# EAGLE board Principal_PCB (EAGLE 8.2.2), part 1 of 2
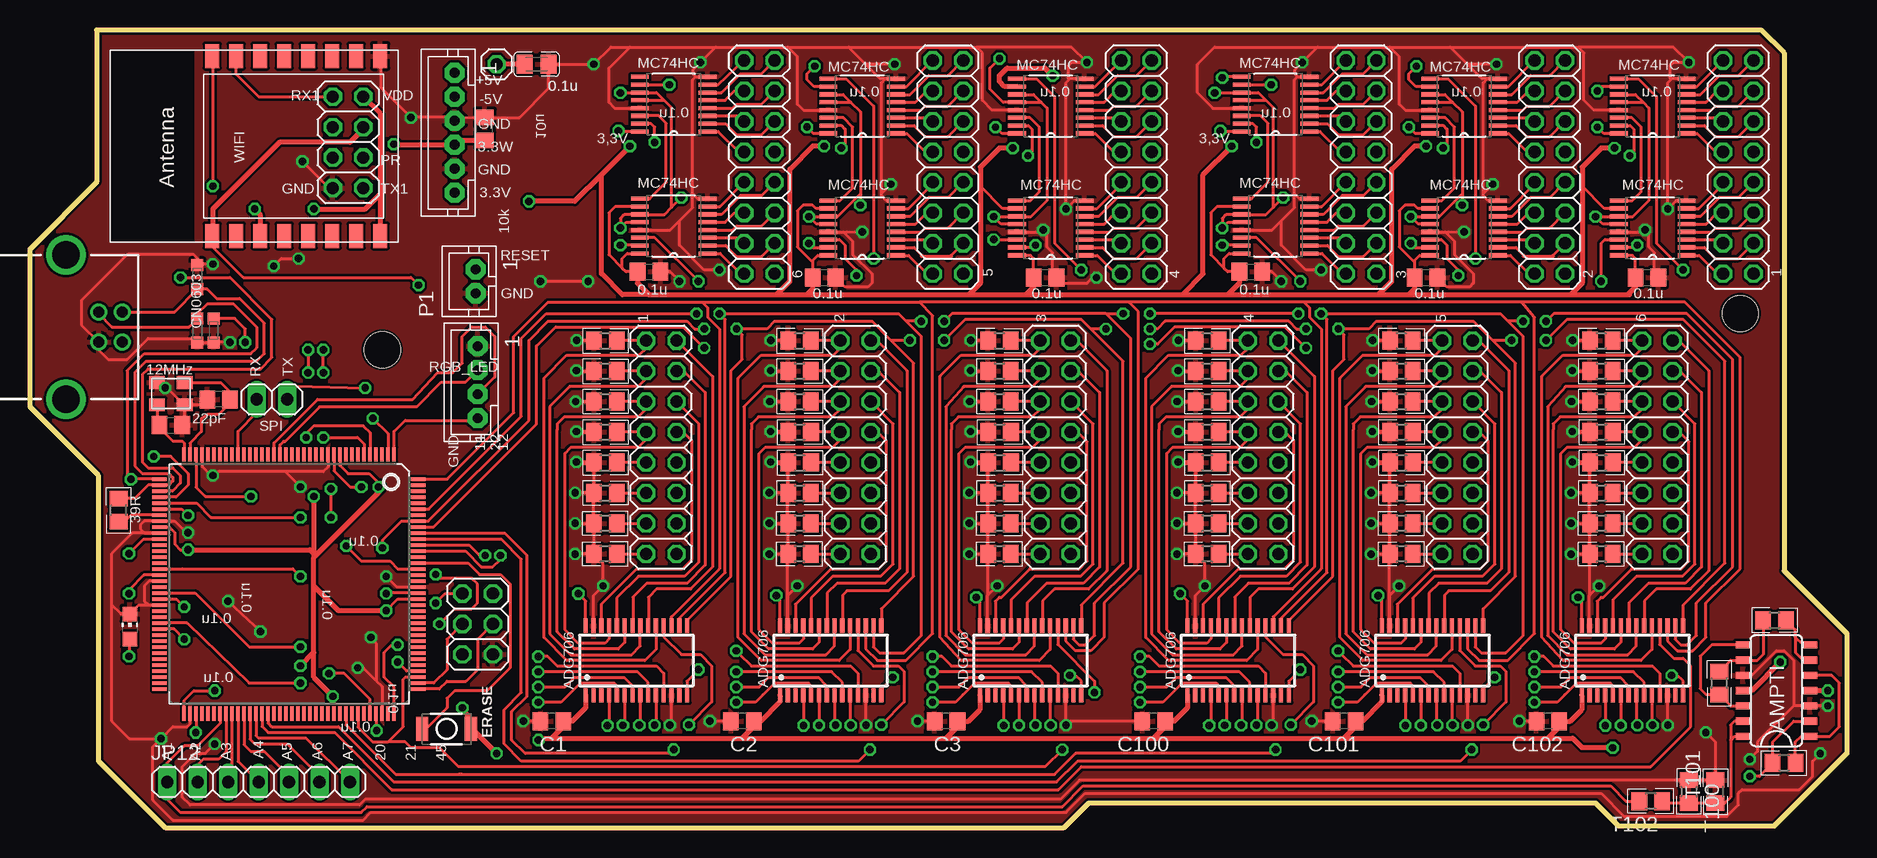
[diagram p7: board, top side]
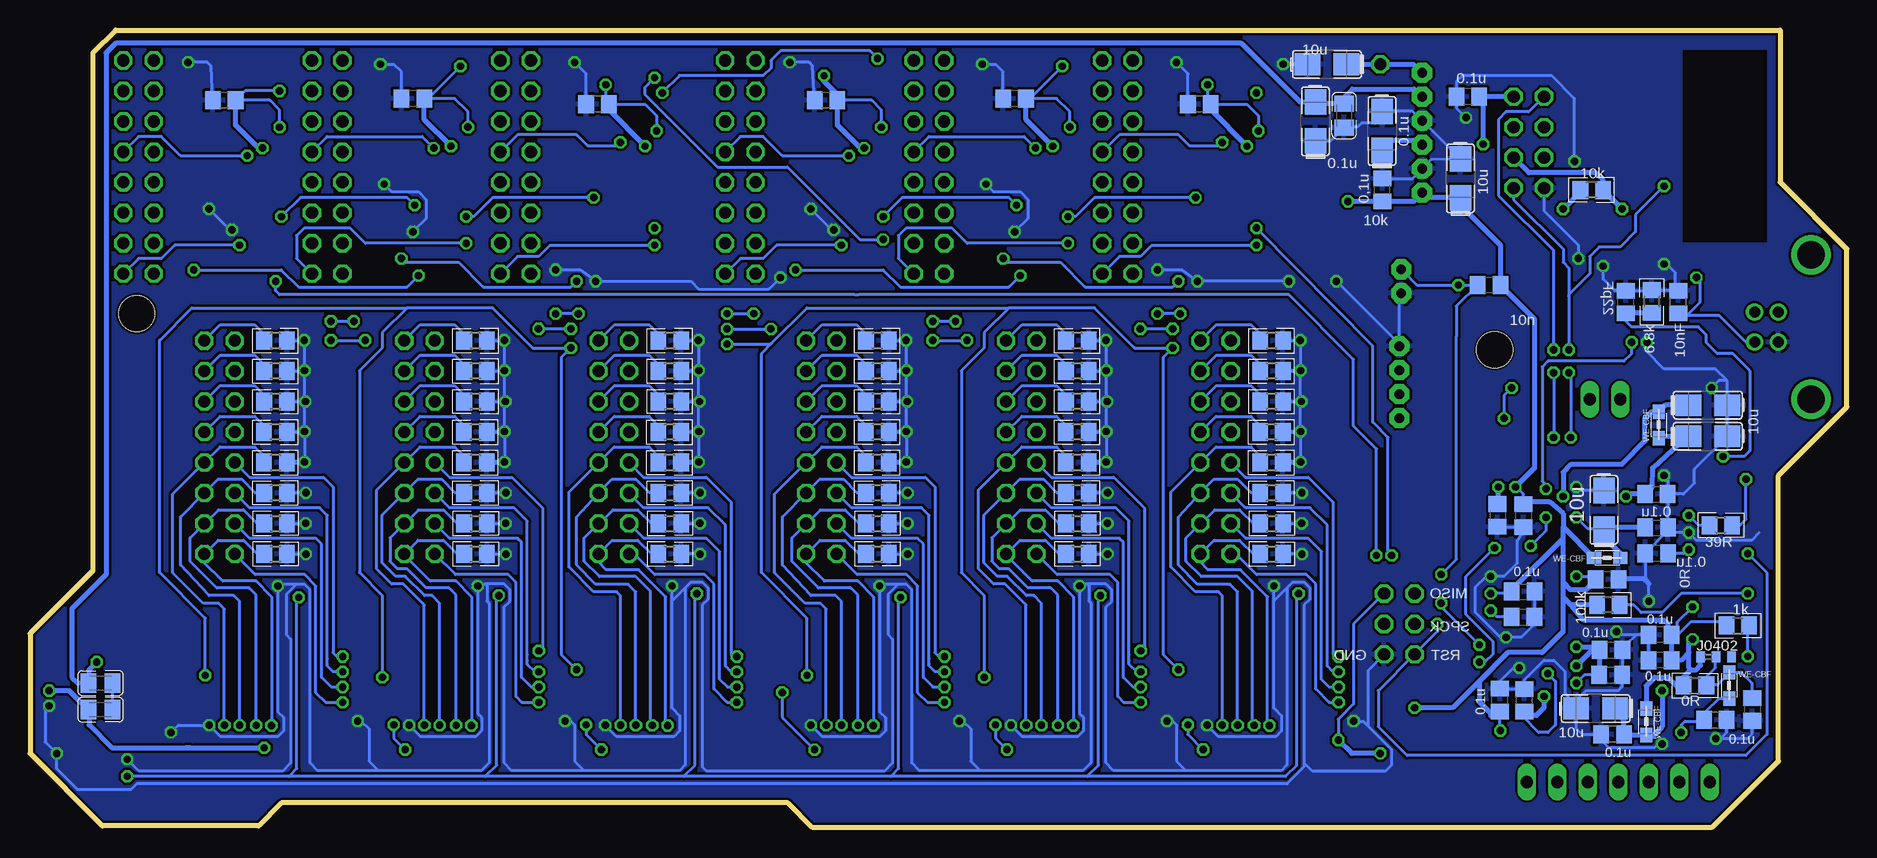
[diagram p8: board, bottom side, seen from below]

Size 151.45 x 66.52 mm. Coordinates in mm from the lower left corner, seen from the top.
Outline: 144.3,66.52 5.56,66.52 5.56,53.82 0,48.26 0,35.08 5.71,29.37 5.71,5.56 11.27,0 86.2,0 88.26,2.06 130.49,2.06 132.4,0.16 145.41,0.16 151.45,6.19 151.45,16.19 146.21,21.43 146.21,64.61 144.3,66.52
Copper layers (1*16): Top 0.035mm / dielectric 1.6mm / Bottom 0.035mm
Design rules "default *": minimum track width 10mil, minimum drill 0.6mm, track to track 8mil, track to pad 8mil, pad to pad 8mil, via to via 8mil, smd to smd 8mil, copper to edge 8mil, drill to drill 8mil, minimum pad ring 10mil, minimum via ring 8mil, stop-mask expansion 4mil, vias tented up to drill 32mil, thermal gap 10mil
Net classes: 1 USB: width 0.203 mm, drill 0.254 mm, clearance 0.203 mm; 2 gnd1: width 0.203 mm, drill 0.254 mm, clearance 0.203 mm; 3 usbvcc: width 0.203 mm, drill 0.254 mm, clearance 0.203 mm; 4 USBpair: width 0.203 mm, drill 0.254 mm, clearance 0.203 mm; 5 UA1: width 0.127 mm, drill 0.254 mm, clearance 0.127 mm
Holes 3 mm at 29.37,39.85 142.56,42.86

## Footprints (pad centres in the part's own frame; a part is rotated, then mirrored left to right if it is on the bottom)
SO014 = smd 0.6 x 1.2: 1 -3.175,-2.8; 2 -1.905,-2.8; 3 -0.635,-2.8; 4 0.635,-2.8; 5 1.905,-2.8; 6 3.175,-2.8; 7 4.445,-2.8; 8 4.445,2.8; 9 3.175,2.8; 10 1.905,2.8; 11 0.635,2.8; 12 -0.635,2.8; 13 -1.905,2.8; 14 -3.175,2.8
J0402 = smd 0.7 x 0.9: 1 -0.65,0; 2 0.65,0; 3 1.95,0
C0805 = smd 1.3 x 1.5: 1 -0.95,0; 2 0.95,0
B/3528-21W = smd 2.15 x 1.8: + 1.625,0; - -1.625,0
C0805K = smd 1.3 x 1.6: 1 -1,0; 2 1,0
SMD_157SW = smd 1.016 x 1.981: 1 -2.032,0; 2 2.032,0
2X08 = drill 1.016 octagon: 1 -8.89,-1.27; 2 -8.89,1.27; 3 -6.35,-1.27; 4 -6.35,1.27; 5 -3.81,-1.27; 6 -3.81,1.27; 7 -1.27,-1.27; 8 -1.27,1.27; 9 1.27,-1.27; 10 1.27,1.27; 11 3.81,-1.27; 12 3.81,1.27; 13 6.35,-1.27; 14 6.35,1.27; 15 8.89,-1.27; 16 8.89,1.27
1X02 = drill 1.016 long: 1 -1.27,0; 2 1.27,0
2X03 = drill 1.016 octagon: 1 -2.54,-1.27; 2 -2.54,1.27; 3 0,-1.27; 4 0,1.27; 5 2.54,-1.27; 6 2.54,1.27
1X01 = drill 1.016 octagon: 1 0,0
2X04 = drill 1.016 octagon: 1 -3.81,-1.27; 2 -3.81,1.27; 3 -1.27,-1.27; 4 -1.27,1.27; 5 1.27,-1.27; 6 1.27,1.27; 7 3.81,-1.27; 8 3.81,1.27
1X07 = drill 1.016 long: 1 -7.62,0; 2 -5.08,0; 3 -2.54,0; 4 0,0; 5 2.54,0; 6 5.08,0; 7 7.62,0
0805 = smd 1.2 x 1: 1 -1.1,0; 2 1.1,0
CHIP-LED0805 = smd 1.2 x 1.2: A 0,-1.05; C 0,1.05
JST-PH2 = drill 0.813 pad 1.676 octagon: 1 1,0; 2 -1,0
JST-PH6 = drill 0.813 pad 1.676 octagon: 1 5,0; 2 3,0; 3 1,0; 4 -1,0; 5 -3,0; 6 -5,0
JST-PH4 = drill 0.813 pad 1.676 octagon: 1 3,0; 2 1,0; 3 -1,0; 4 -3,0
R0805 = smd 1.3 x 1.5: 1 -0.95,0; 2 0.95,0
SOP65P640X120-16N = smd 1.473 x 0.356: 1 -2.819,2.286; 2 -2.819,1.626; 3 -2.819,0.965; 4 -2.819,0.33; 5 -2.819,-0.33; 6 -2.819,-0.965; 7 -2.819,-1.626; 8 -2.819,-2.286; 9 2.819,-2.286; 10 2.819,-1.626; 11 2.819,-0.965; 12 2.819,-0.33; 13 2.819,0.33; 14 2.819,0.965; 15 2.819,1.626; 16 2.819,2.286
LQFP144 = smd 0.3 x 1.2: 1 -8.75,-10.8; 2 -8.25,-10.8; 3 -7.75,-10.8; 4 -7.25,-10.8; 5 -6.75,-10.8; 6 -6.25,-10.8; 7 -5.75,-10.8; 8 -5.25,-10.8; 9 -4.75,-10.8; 10 -4.25,-10.8; 11 -3.75,-10.8; 12 -3.25,-10.8; 13 -2.75,-10.8; 14 -2.25,-10.8; 15 -1.75,-10.8; 16 -1.25,-10.8; 17 -0.75,-10.8; 18 -0.25,-10.8; 19 0.25,-10.8; 20 0.75,-10.8; 21 1.25,-10.8; 22 1.75,-10.8; 23 2.25,-10.8; 24 2.75,-10.8; 25 3.25,-10.8; 26 3.75,-10.8; 27 4.25,-10.8; 28 4.75,-10.8; 29 5.25,-10.8; 30 5.75,-10.8; 31 6.25,-10.8; 32 6.75,-10.8; 33 7.25,-10.8; 34 7.75,-10.8; 35 8.25,-10.8; 36 8.75,-10.8; 73 8.75,10.8; 74 8.25,10.8; 75 7.75,10.8; 76 7.25,10.8; 77 6.75,10.8; 78 6.25,10.8; 79 5.75,10.8; 80 5.25,10.8; 81 4.75,10.8; 82 4.25,10.8; 83 3.75,10.8; 84 3.25,10.8; 85 2.75,10.8; 86 2.25,10.8; 87 1.75,10.8; 88 1.25,10.8; 89 0.75,10.8; 90 0.25,10.8; 91 -0.25,10.8; 92 -0.75,10.8; 93 -1.25,10.8; 94 -1.75,10.8; 95 -2.25,10.8; 96 -2.75,10.8; 97 -3.25,10.8; 98 -3.75,10.8; 99 -4.25,10.8; 100 -4.75,10.8; 101 -5.25,10.8; 102 -5.75,10.8; 103 -6.25,10.8; 104 -6.75,10.8; 105 -7.25,10.8; 106 -7.75,10.8; 107 -8.25,10.8; 108 -8.75,10.8 | smd 1.2 x 0.3: 37 10.8,-8.75; 38 10.8,-8.25; 39 10.8,-7.75; 40 10.8,-7.25; 41 10.8,-6.75; 42 10.8,-6.25; 43 10.8,-5.75; 44 10.8,-5.25; 45 10.8,-4.75; 46 10.8,-4.25; 47 10.8,-3.75; 48 10.8,-3.25; 49 10.8,-2.75; 50 10.8,-2.25; 51 10.8,-1.75; 52 10.8,-1.25; 53 10.8,-0.75; 54 10.8,-0.25; 55 10.8,0.25; 56 10.8,0.75; 57 10.8,1.25; 58 10.8,1.75; 59 10.8,2.25; 60 10.8,2.75; 61 10.8,3.25; 62 10.8,3.75; 63 10.8,4.25; 64 10.8,4.75; 65 10.8,5.25; 66 10.8,5.75; 67 10.8,6.25; 68 10.8,6.75; 69 10.8,7.25; 70 10.8,7.75; 71 10.8,8.25; 72 10.8,8.75; 109 -10.8,8.75; 110 -10.8,8.25; 111 -10.8,7.75; 112 -10.8,7.25; 113 -10.8,6.75; 114 -10.8,6.25; 115 -10.8,5.75; 116 -10.8,5.25; 117 -10.8,4.75; 118 -10.8,4.25; 119 -10.8,3.75; 120 -10.8,3.25; 121 -10.8,2.75; 122 -10.8,2.25; 123 -10.8,1.75; 124 -10.8,1.25; 125 -10.8,0.75; 126 -10.8,0.25; 127 -10.8,-0.25; 128 -10.8,-0.75; 129 -10.8,-1.25; 130 -10.8,-1.75; 131 -10.8,-2.25; 132 -10.8,-2.75; 133 -10.8,-3.25; 134 -10.8,-3.75; 135 -10.8,-4.25; 136 -10.8,-4.75; 137 -10.8,-5.25; 138 -10.8,-5.75; 139 -10.8,-6.25; 140 -10.8,-6.75; 141 -10.8,-7.25; 142 -10.8,-7.75; 143 -10.8,-8.25; 144 -10.8,-8.75
TSSOP28 = smd 0.35 x 1.2: 1 -4.225,-2.9; 2 -3.575,-2.9; 3 -2.925,-2.9; 4 -2.275,-2.9; 5 -1.625,-2.9; 6 -0.975,-2.9; 7 -0.325,-2.9; 8 0.325,-2.9; 9 0.975,-2.9; 10 1.625,-2.9; 11 2.275,-2.9; 12 2.925,-2.9; 13 3.575,-2.9; 14 4.225,-2.9; 15 4.225,2.9; 16 3.575,2.9; 17 2.925,2.9; 18 2.275,2.9; 19 1.625,2.9; 20 0.975,2.9; 21 0.325,2.9; 22 -0.325,2.9; 23 -0.975,2.9; 24 -1.625,2.9; 25 -2.275,2.9; 26 -2.925,2.9; 27 -3.575,2.9; 28 -4.225,2.9
ESP-12 = smd 2 x 1.2: 1 -7.5,4.5; 2 -7.5,2.5; 3 -7.5,0.5; 4 -7.5,-1.5; 5 -7.5,-3.5; 6 -7.5,-5.5; 7 -7.5,-7.5; 8 -7.5,-9.5; 9 7.5,-9.5; 10 7.5,-7.5; 11 7.5,-5.5; 12 7.5,-3.5; 13 7.5,-1.5; 14 7.5,0.5; 15 7.5,2.5; 16 7.5,4.5
USB-B-PTH = drill 0.914: D+ 0,1.25; D- 1.981,1.25; GND 0,-1.25; VBUS 1.981,-1.25 | drill 2.286: P$1 -2.718,-6.02; P$2 -2.718,6.02
CRYSTAL-3.2-2.5 = smd 1.3 x 1.05: 1 -1.15,-0.925; 2 1.15,-0.925; 3 1.15,0.925; 4 -1.15,0.925
CT/CN0603 = smd 1 x 1: 1 -1,0; 2 1,0

## Placement (x,y rotation side)
AMPTI  LMV324  [SO014]  145.57,10.8 90 top
BR1  NM  [J0402]  10.25,14.24 180 bottom
C1  [C0805]  43.5,8.89 180 top
C2  [C0805]  59.37,8.89 180 top
C3  [C0805]  76.36,8.89 180 top
C4  [C0805]  84.61,45.88 0 top
C5  [C0805]  85.09,60.64 180 bottom
C6  [C0805]  66.2,45.88 0 top
C7  0.1uF  [C0805]  69.37,60.8 180 bottom
C8  [C0805]  51.59,46.36 0 top
C9  [C0805]  53.98,60.33 180 bottom
C100  [C0805]  93.66,8.89 180 top
C101  [C0805]  109.54,8.89 180 top
C102  [C0805]  126.52,8.89 180 top
C103  [C0805]  101.76,46.36 0 top
C104  [C0805]  116.36,45.88 0 top
C105  [C0805]  134.78,45.88 0 top
C106  [C0805]  104.14,60.33 180 bottom
C107  0.1uF  [C0805]  119.54,60.8 180 bottom
C108  [C0805]  135.25,60.64 180 bottom
CA1  0,1u  [C0805]  38.73,53.18 90 bottom
CA2  10u  [B/3528-21W]  32.2,54.15 270 bottom
CA3  100n  [C0805]  28.92,10.65 90 bottom
CA4  100n  [C0805]  15.57,16.1 180 bottom
CA5  100n  [C0805]  15.57,13.97 180 bottom
CA6  100n  [C0805]  19.99,20.7 0 bottom
CA7  100n  [C0805]  37.91,58.27 90 top
CA8  100n  [C0805]  26.96,26.02 270 bottom
CA9  100n  [C0805]  26.99,19.69 0 bottom
CA10  100n  [C0805]  15.86,25.02 0 bottom
CA11  10u  [B/3528-21W]  20.24,26.5 270 bottom
CA12  100n  [C0805]  19.54,7.78 180 bottom
CA13  10u  [B/3528-21W]  20.95,9.95 0 bottom
CA14  10u  [B/3528-21W]  11.6,35.23 180 bottom
CA15  100n  [C0805]  19.67,14.83 0 bottom
CA16  100n  [C0805]  19.7,12.73 0 bottom
CA17  100n  [C0805]  29.11,26.05 270 bottom
CA18  100n  [C0805]  15.86,22.86 180 bottom
CA19  100n  [C0805]  26.89,10.62 90 bottom
CA20  100n  [C0805]  27,17.59 0 bottom
CA21  10n  [C0805]  29.83,45.23 180 bottom
CA22  100n  [C0805]  7.89,9.86 270 bottom
CA23  100n  [C0805]  10.97,8.99 0 bottom
CA24  22p  [C0805]  11.73,33.56 0 top
CA25  22pF  [C0805]  15.73,35.72 180 top
CA26  100n  [C0805]  15.89,27.81 0 bottom
CA27  10u  [B/3528-21W]  11.6,32.63 180 bottom
CA28  0.1u  [C0805K]  145.57,9.84 0 bottom
CA29  0.1u  [C0805K]  145.57,12.06 180 bottom
CA35  22p  [C0805]  18.41,43.83 90 bottom
CA36  10n  [C0805]  14.07,43.83 90 bottom
CA37  10uF  [B/3528-21W]  43.34,63.66 0 bottom
CA38  100n  [C0805]  31.59,60.96 180 bottom
CA49  10u  [B/3528-21W]  38.73,58.1 270 bottom
CA50  10uF  [B/3528-21W]  44.29,58.9 270 bottom
CA51  0.1u  [C0805K]  41.91,59.37 270 bottom
CA54  0.1u  [C0805K]  42.23,63.66 0 top
ERASE  [SMD_157SW]  34.72,8.24 180 top
JP1  [2X08]  142.4,55.09 90 top
JP2  [2X08]  126.68,55.09 90 top
JP3  [2X08]  110.97,55.09 90 top
JP4  [2X08]  92.23,55.09 90 top
JP5  [2X08]  76.52,55.09 90 top
JP6  [2X08]  60.8,55.09 90 top
JP8  [1X02]  20.16,35.72 0 top
JP9  [2X03]  37.31,16.99 270 top
JP10  [1X01]  38.89,63.66 0 top
JP11  [2X04]  26.51,57.15 270 top
JP12  [1X07]  19.05,3.81 0 top
JPP1  [2X08]  52.62,31.72 90 top
JPP2  [2X08]  68.81,31.72 90 top
JPP3  [2X08]  85.48,31.72 90 top
JPP4  [2X08]  102.79,31.72 90 top
JPP5  [2X08]  118.98,31.72 90 top
JPP6  [2X08]  135.65,31.72 90 top
L1  MH2029-300Y  [0805]  16.72,8.84 270 bottom
L2  MH2029-300Y  [0805]  19.98,22.49 0 bottom
L3  MH2029-300Y  [0805]  9.82,11.86 270 bottom
L5  MH2029-300Y  [0805]  15.69,33.59 270 bottom
ON  GREEN  [CHIP-LED0805]  8.32,16.76 0 top
P1  [JST-PH2]  37.15,45.56 90 top
P2  [JST-PH6]  35.4,57.94 90 top
P4  [JST-PH4]  37.31,37.15 90 top
RA3  1k  [R0805]  9.09,16.86 0 bottom
RA4  0R  [R0805]  12.67,11.86 0 bottom
RA5  100k  [R0805]  19.89,18.57 180 bottom
RA7  39R 1%  [R0805]  7.38,26.48 90 top
RA8  39R 1%  [R0805]  10.51,25.22 0 bottom
RA9  6K8 1%  [R0805]  16.26,43.88 90 bottom
RF4  10k  [R0805]  21.27,53.18 180 bottom
T1  [R0805]  47.95,40.6 0 top
T2  [R0805]  47.95,40.6 180 bottom
T3  [R0805]  47.95,38.07 0 top
T4  [R0805]  47.95,38.07 180 bottom
T5  [R0805]  47.95,35.54 180 bottom
T6  [R0805]  47.96,32.99 180 bottom
T7  [R0805]  47.96,30.44 180 bottom
T8  [R0805]  47.95,27.91 0 top
T9  [R0805]  98.12,38.07 0 top
T10  [R0805]  47.95,25.37 180 top
T11  [R0805]  47.95,25.37 0 bottom
T12  [R0805]  47.95,22.83 180 top
T13  [R0805]  47.95,22.83 0 bottom
T14  [R0805]  47.95,35.54 0 top
T15  [R0805]  47.96,32.99 0 top
T16  [R0805]  47.96,30.44 0 top
T17  [R0805]  47.95,27.91 180 bottom
T18  [R0805]  64.15,40.6 0 top
T19  [R0805]  64.15,40.6 180 bottom
T20  [R0805]  64.15,38.07 0 top
T21  [R0805]  64.15,38.07 180 bottom
T22  [R0805]  64.15,35.54 0 top
T23  [R0805]  64.16,32.99 0 top
T24  [R0805]  64.16,30.44 0 top
T25  [R0805]  64.15,27.91 0 top
T26  [R0805]  64.15,25.37 180 top
T27  [R0805]  64.15,25.37 0 bottom
T28  [R0805]  64.15,22.83 180 top
T29  [R0805]  64.15,22.83 0 bottom
T30  [R0805]  64.15,35.54 180 bottom
T31  [R0805]  64.16,32.99 180 bottom
T32  [R0805]  64.16,30.44 180 bottom
T33  [R0805]  64.15,27.91 180 bottom
T34  [R0805]  80.81,40.6 0 top
T35  [R0805]  80.81,40.6 180 bottom
T36  [R0805]  80.81,38.07 0 top
T37  [R0805]  80.81,38.07 180 bottom
T38  [R0805]  80.81,35.54 180 bottom
T39  [R0805]  80.82,32.99 0 top
T40  [R0805]  80.82,30.44 0 top
T41  [R0805]  80.81,27.91 0 top
T42  [R0805]  80.81,25.37 180 top
T43  [R0805]  80.81,25.37 0 bottom
T44  [R0805]  80.81,22.83 180 top
T45  [R0805]  80.81,22.83 0 bottom
T46  [R0805]  80.81,35.54 0 top
T47  [R0805]  80.82,32.99 180 bottom
T48  [R0805]  80.82,30.44 180 bottom
T49  [R0805]  80.81,27.91 180 bottom
T50  [R0805]  98.12,38.07 180 bottom
T51  [R0805]  98.12,35.54 0 top
T52  [R0805]  146.21,5.4 180 top
T53  [R0805]  145.41,17.3 0 top
T54  [R0805]  140.81,12.06 90 top
T55  [R0805]  98.12,35.54 180 bottom
T56  [R0805]  98.13,32.99 0 top
T57  [R0805]  98.13,32.99 180 bottom
T58  [R0805]  98.13,30.44 0 top
T59  [R0805]  98.13,30.44 180 bottom
T60  [R0805]  98.12,27.91 0 top
T61  [R0805]  98.12,27.91 180 bottom
T62  [R0805]  98.12,22.83 180 top
T63  [R0805]  98.12,22.83 0 bottom
T64  [R0805]  98.12,40.6 180 bottom
T65  [R0805]  98.12,25.37 0 bottom
T66  [R0805]  98.12,40.6 0 top
T67  [R0805]  98.12,25.37 180 top
T68  [R0805]  114.31,38.07 0 top
T69  [R0805]  114.31,38.07 180 bottom
T70  [R0805]  114.31,35.54 0 top
T71  [R0805]  114.31,35.54 180 bottom
T72  [R0805]  114.32,32.99 0 top
T73  [R0805]  114.32,32.99 180 bottom
T74  [R0805]  114.32,30.44 0 top
T75  [R0805]  114.32,30.44 180 bottom
T76  [R0805]  114.31,27.91 0 top
T77  [R0805]  114.31,27.91 180 bottom
T78  [R0805]  114.31,22.83 180 top
T79  [R0805]  114.31,22.83 0 bottom
T80  [R0805]  114.31,40.6 180 bottom
T81  [R0805]  114.31,25.37 0 bottom
T82  [R0805]  114.31,40.6 0 top
T83  [R0805]  114.31,25.37 180 top
T84  [R0805]  130.98,38.07 0 top
T85  [R0805]  130.98,38.07 180 bottom
T86  [R0805]  130.98,35.54 0 top
T87  [R0805]  130.98,35.54 180 bottom
T88  [R0805]  130.99,32.99 0 top
T89  [R0805]  130.99,32.99 180 bottom
T90  [R0805]  130.99,30.44 0 top
T91  [R0805]  130.99,30.44 180 bottom
T92  [R0805]  130.98,27.91 0 top
T93  [R0805]  130.98,27.91 180 bottom
T94  [R0805]  130.98,22.83 180 top
T95  [R0805]  130.98,22.83 0 bottom
T96  [R0805]  130.98,40.6 180 bottom
T97  [R0805]  130.98,25.37 0 bottom
T98  [R0805]  130.98,40.6 0 top
T99  [R0805]  130.98,25.37 180 top
T100  [R0805]  138.27,3.02 270 top
T101  [R0805]  140.49,3.02 90 top
T102  [R0805]  135.1,2.22 180 top
U4  MC74HC595ADTR2G  [SOP65P640X120-16N]  85.09,50.01 180 top
U5  MC74HC595ADTR2G  [SOP65P640X120-16N]  85.09,60.17 180 top
U6  MC74HC595ADTR2G  [SOP65P640X120-16N]  69.37,50.01 180 top
U7  MC74HC595ADTR2G  [SOP65P640X120-16N]  69.37,60.17 180 top
U8  MC74HC595ADTR2G  [SOP65P640X120-16N]  53.66,50.17 180 top
U9  MC74HC595ADTR2G  [SOP65P640X120-16N]  53.66,60.33 180 top
UA1  ATSAM3X8EA-AU  [LQFP144]  21.59,20.32 180 top
UU1  ADG706BRU  [TSSOP28]  50.54,13.94 0 top
UU2  ADG706BRU  [TSSOP28]  66.73,13.94 0 top
UU3  ADG706BRU  [TSSOP28]  83.4,13.94 0 top
UU4  ADG706BRU  [TSSOP28]  100.71,13.94 0 top
UU5  ADG706BRU  [TSSOP28]  116.9,13.94 0 top
UU6  ADG706BRU  [TSSOP28]  133.57,13.94 0 top
UUU1  MC74HC595ADTR2G  [SOP65P640X120-16N]  135.25,50.01 180 top
UUU2  MC74HC595ADTR2G  [SOP65P640X120-16N]  135.25,60.17 180 top
UUU3  MC74HC595ADTR2G  [SOP65P640X120-16N]  119.54,50.01 180 top
UUU4  MC74HC595ADTR2G  [SOP65P640X120-16N]  119.54,60.17 180 top
UUU5  MC74HC595ADTR2G  [SOP65P640X120-16N]  103.82,50.17 180 top
UUU6  MC74HC595ADTR2G  [SOP65P640X120-16N]  103.82,60.33 180 top
X1  [ESP-12]  19.69,56.83 90 top
X3  USBPTH  [USB-B-PTH]  5.71,41.75 0 top
Y1  12MHz KX-7 20pF  [CRYSTAL-3.2-2.5]  11.75,36.2 0 top
Z1  CG0603MLC-05E  [CT/CN0603]  13.96,41.45 270 top
Z2  CG0603MLC-05E  [CT/CN0603]  13.96,45.9 90 top
Z5  CG0603MLC-05E  [CT/CN0603]  15.31,41.46 90 top

## Tracks (layer width: path | path; a pad name or v marks a point on that pad's centre or on a via)
49
  Top 0.254: JPP4.15 104.58,40.13 107.07,37.64 107.07,21.75 105.23,19.91 102.39,19.91 101.71,19.22 101.71,16.87 UU4.20
  Bottom 0.254: JPP4.15 102.73,41.94 99.84,41.94 99.07,41.17 T64.2
50
  Top 0.254: T66.2 JPP4.16 101.59,40.54 101.59,40.03 100.95,39.39 94.91,39.39 93,37.49 93,15.86 94.91,13.95 101.43,13.95 102.33,14.86 UU4.19
51
  Top 0.254: T9.2 JPP4.14 101.52,37.45 100.85,36.78 95.16,36.78 | 95.16,36.78 95.11,36.78 | 95.16,36.78 93.48,35.1 93.48,16.18 95.23,14.43 100.32,14.43 101.03,15.15 UU4.21
52
  Top 0.254: T51.2 99.06,35.53 JPP4.12 101.52,34.93 100.84,34.25 94.7,34.25 94.12,33.67 94.12,33.19 | UU4.23 99.73,15.44 99.2,14.91 95.55,14.91 94.12,16.34 94.12,33.19 | 94.12,33.19
53
  Top 0.254: UU4.24 99.08,19.15 100.88,20.96 104.72,20.96 105.92,22.15 105.92,33.67 JPP4.11
  Bottom 0.254: JPP4.11 102.74,36.85 99.84,36.85 99.07,36.08 T55.2
54
  Top 0.254: T56.2 JPP4.10 101.52,32.36 100.85,31.69 95.23,31.69 94.75,31.22 94.75,16.5 95.87,15.38 98.09,15.38 98.43,15.73 UU4.25
55
  Top 0.254: JPP4.9 104.61,32.99 105.31,32.29 105.31,22.35 104.51,21.55 100.7,21.55 97.78,18.63 UU4.26
  Bottom 0.254: JPP4.9 102.74,34.31 99.84,34.31 99.08,33.54 T57.2
56  (via drill 0.61)
  Top 0.254: UU4.10 102.33,8.65 v102.22,8.55
  Bottom 0.254: v102.22,8.55 102.22,19.35 102.54,19.67 104.45,19.67 106.52,21.73 106.52,27.99 JPP4.7 102.75,31.76 99.84,31.76 99.08,31 T59.2
57  (via drill 0.61)
  Top 0.254: JPP4.8 T58.2 | UU4.11 102.98,12.88 102.38,13.48 94.12,13.48 93.32,14.27 v92.53,14.27
  Bottom 0.254: JPP4.8 100.29,29.22 95.07,29.22 93,27.15 93,14.43 92.84,14.27 v92.53,14.27
58  (via drill 0.61)
  Top 0.254: UU4.8 101.03,8.63 v100.95,8.55
  Bottom 0.254: v100.95,8.55 100.95,19.67 101.59,20.3 104.29,20.3 105.88,21.89 105.88,25.93 JPP4.5 102.91,29.06 100.95,29.06 99.84,27.95 99.1,27.95 T61.2
59  (via drill 0.61)
  Top 0.254: T60.2 JPP4.6 | UU4.9 101.68,12.11 100.79,13 v92.53,13
  Bottom 0.254: v92.53,13 93,13 93.48,13.48 93.48,14.11 93.48,14.59 93.48,25.24 94.91,26.67 100.28,26.67 JPP4.6
60  (via drill 0.61)
  Top 0.254: UU4.6 99.73,8.69 v99.58,8.53
  Bottom 0.254: T65.1 99.65,25.37 100.79,26.52 102.86,26.52 104.01,25.37 JPP4.3 105.25,24.18 105.25,22.21 103.97,20.94 100.95,20.94 99.74,19.72 99.74,8.69 v99.58,8.53
61  (via drill 0.61)
  Top 0.254: T67.1 JPP4.4 | UU4.7 100.38,11.82 99.68,12.52 95.55,12.52 94.75,11.73 v92.53,11.73
  Bottom 0.254: JPP4.4 100.28,24.13 95.07,24.13 93.96,23.02 93.96,12.36 93.32,11.73 v92.53,11.73
62  (via drill 0.61)
  Top 0.254: UU4.4 98.43,8.65 v98.3,8.52
  Bottom 0.254: T63.1 99.65,22.83 100.79,23.97 102.92,23.97 JPP4.1 104.06,22.14 103.43,21.51 102.68,21.51 100.7,21.51 98.46,19.27 98.46,8.68 v98.3,8.52
63  (via drill 0.61)
  Top 0.254: T62.1 JPP4.2 | UU4.5 99.08,11.85 98.89,12.05 96.02,12.05 95.07,11.09 | 95.07,11.09 | 95.07,11.09 94.43,10.46 v92.53,10.46
  Bottom 0.254: v92.53,10.46 93.32,10.46 94.44,11.57 94.44,20.31 95.23,21.11 99.37,21.11 101.09,22.83 JPP4.2
64
  Top 0.254: JPP4.13 104.75,38.07 104.75,38.01 106.46,36.3 106.46,21.9 104.94,20.39 101.56,20.39 100.42,19.24 100.42,16.87 UU4.22
  Bottom 0.254: JPP4.13 102.73,39.39 99.84,39.39 99.07,38.62 T50.2
65
  Top 0.254: JPP5.15 120.77,40.61 123.27,38.11 123.27,21.27 121.74,19.75 118.27,19.75 117.9,19.38 117.9,16.87 UU5.20
  Bottom 0.254: JPP5.15 118.92,41.94 116.03,41.94 115.26,41.17 T80.2
66
  Top 0.254: T82.2 JPP5.16 117.78,40.54 117.78,40.03 117.15,39.39 111.1,39.39 109.2,37.49 109.2,15.86 111.1,13.95 117.62,13.95 118.53,14.86 UU5.19
67
  Top 0.254: T68.2 JPP5.14 117.71,37.45 117.04,36.78 111.35,36.78 | 111.35,36.78 111.3,36.78 | 111.35,36.78 109.67,35.1 109.67,16.18 111.42,14.43 116.51,14.43 117.22,15.15 UU5.21
68
  Top 0.254: T70.2 115.25,35.53 JPP5.12 117.71,34.93 117.03,34.25 110.89,34.25 110.31,33.67 110.31,33.19 | UU5.23 115.93,15.44 115.4,14.91 111.74,14.91 110.31,16.34 110.31,33.19 | 110.31,33.19
69
  Top 0.254: UU5.24 115.27,19.15 117.07,20.96 121.08,20.96 122.11,21.99 122.11,33.67 JPP5.11
  Bottom 0.254: JPP5.11 118.93,36.85 116.03,36.85 115.26,36.08 T71.2
70
  Top 0.254: T72.2 JPP5.10 117.71,32.36 117.04,31.69 111.42,31.69 110.94,31.22 110.94,16.5 112.06,15.38 114.28,15.38 114.62,15.73 UU5.25
71
  Top 0.254: JPP5.9 120.8,32.99 121.5,32.29 121.5,22.19 120.87,21.55 116.89,21.55 113.97,18.63 UU5.26
  Bottom 0.254: JPP5.9 118.93,34.31 116.03,34.31 115.27,33.54 T73.2
72  (via drill 0.61)
  Top 0.254: UU5.10 118.53,8.65 v118.58,8.55
  Bottom 0.254: v118.58,8.55 118.58,18.56 118.74,18.71 118.74,18.72 120.33,20.32 121.28,20.32 122.56,21.59 122.56,28.14 122.55,28.15 JPP5.7 118.94,31.76 116.03,31.76 115.27,31 T75.2
73  (via drill 0.61)
  Top 0.254: JPP5.8 T74.2 | UU5.11 119.18,12.88 118.58,13.48 110.31,13.48 109.35,14.43 v109.04,14.75
  Bottom 0.254: JPP5.8 116.48,29.22 111.26,29.22 108.72,26.68 108.72,15.07 108.88,14.91 v109.04,14.75
74  (via drill 0.61)
  Top 0.254: UU5.8 117.22,8.63 v117.31,8.55
  Bottom 0.254: v117.31,8.55 117.31,18.71 117.94,19.35 118.57,19.35 120.17,20.95 120.97,20.95 122.08,22.07 122.08,26.08 JPP5.5 119.1,29.06 117.15,29.06 116.03,27.95 115.3,27.95 T77.2
75  (via drill 0.61)
  Top 0.254: T76.2 JPP5.6 | UU5.9 117.88,12.11 116.99,13 v109.04,13
  Bottom 0.254: v109.04,13 109.35,13 109.99,13.64 109.99,13.95 109.99,14.43 109.99,25.56 111.1,26.67 116.47,26.67 JPP5.6
76  (via drill 0.61)
  Top 0.254: UU5.6 v115.93,8.53
  Bottom 0.254: v115.93,8.53 115.93,19.41 116.53,20 118.43,20 120.01,21.59 120.81,21.59 121.44,22.22 121.44,24.18 JPP5.3 120.2,25.37 119.05,26.52 116.99,26.52 115.84,25.37 T81.1
77  (via drill 0.61)
  Top 0.254: T83.1 JPP5.4 | UU5.7 116.57,11.82 115.87,12.52 111.74,12.52 110.94,11.73 v109.04,11.73
  Bottom 0.254: JPP5.4 116.47,24.13 110.79,24.13 110.47,23.81 110.47,12.52 109.67,11.73 v109.04,11.73
78  (via drill 0.61)
  Top 0.254: UU5.4 114.62,8.54 v114.65,8.52
  Bottom 0.254: T79.1 115.85,22.83 116.99,23.97 119.11,23.97 JPP5.1 120.25,22.73 118.08,20.56 115.94,20.56 114.65,19.27 v114.65,8.52
79  (via drill 0.61)
  Top 0.254: T78.1 JPP5.2 | UU5.5 115.28,11.85 115.08,12.05 112.22,12.05 111.26,11.09 | 111.26,11.09 | 111.26,11.09 110.63,10.46 v109.04,10.46
  Bottom 0.254: JPP5.2 115.99,21.11 111.58,21.11 110.94,20.47 110.94,10.93 110.47,10.46 v109.04,10.46
80
  Top 0.254: JPP5.13 120.94,38.07 120.94,38.01 122.65,36.3 122.65,21.58 121.45,20.39 117.44,20.39 116.61,19.56 116.61,16.87 UU5.22
  Bottom 0.254: JPP5.13 118.93,39.39 116.03,39.39 115.26,38.62 T69.2
81
  Top 0.254: JPP6.15 137.44,40.61 139.94,38.11 139.94,21.43 138.41,19.91 135.57,19.91 134.57,18.9 134.57,16.87 UU6.20
  Bottom 0.254: JPP6.15 135.59,41.94 132.7,41.94 131.93,41.17 T96.2
82
  Top 0.254: T98.2 JPP6.16 134.45,40.54 134.45,40.03 133.81,39.39 127.77,39.39 126.02,37.65 126.02,15.86 127.77,13.95 134.29,13.95 135.19,14.86 UU6.19
83
  Top 0.254: T84.2 JPP6.14 134.38,37.45 133.71,36.78 128.02,36.78 | 128.02,36.78 127.97,36.78 | 128.02,36.78 126.5,35.1 126.5,16.02 128.09,14.43 133.18,14.43 133.89,15.15 UU6.21
84
  Top 0.254: T86.2 131.92,35.53 JPP6.12 134.38,34.93 133.7,34.25 127.56,34.25 126.98,33.67 126.98,33.19 | UU6.23 132.59,15.44 132.07,14.91 128.41,14.91 126.98,16.34 126.98,33.19 | 126.98,33.19
85
  Top 0.254: UU6.24 131.94,19 133.9,20.96 137.74,20.96 138.78,21.99 138.78,33.67 JPP6.11
  Bottom 0.254: JPP6.11 135.6,36.85 132.7,36.85 131.93,36.08 T87.2
86
  Top 0.254: T88.2 JPP6.10 134.38,32.36 133.71,31.69 128.09,31.69 127.61,31.22 127.61,16.5 128.73,15.38 130.95,15.38 131.29,15.73 UU6.25
87
  Top 0.254: JPP6.9 137.47,32.99 138.27,32.19 138.27,22.23 137.64,21.59 133.51,21.59 131.13,19.21 130.97,19.21 130.64,18.88 UU6.26
  Bottom 0.254: JPP6.9 135.6,34.31 132.7,34.31 131.94,33.54 T89.2
88  (via drill 0.61)
  Top 0.254: UU6.10 135.19,8.65 v135.25,8.55
  Bottom 0.254: v135.25,8.55 135.25,18.24 135.72,18.71 137,18.71 139.54,21.26 139.54,27.83 JPP6.7 135.61,31.76 132.7,31.76 131.94,31 T91.2
89  (via drill 0.61)
  Top 0.254: JPP6.8 T90.2 | UU6.11 135.84,12.88 135.25,13.48 126.98,13.48 126.18,14.27 v125.39,14.27
  Bottom 0.254: JPP6.8 133.15,29.22 126.98,29.22 126.18,28.42 126.18,14.59 125.87,14.27 v125.39,14.27
90  (via drill 0.61)
  Top 0.254: UU6.8 133.89,8.63 v133.97,8.55
  Bottom 0.254: v133.97,8.55 133.97,18.87 134.45,19.35 136.52,19.35 138.9,21.89 138.9,25.93 JPP6.5 135.77,29.06 133.81,29.06 132.7,27.95 131.97,27.95 T93.2
91  (via drill 0.61)
  Top 0.254: T92.2 JPP6.6 | UU6.9 134.54,12.11 133.66,13 v125.39,13
  Bottom 0.254: v125.39,13 126.18,13 126.66,13.48 126.66,13.64 126.66,14.11 126.66,26.04 127.3,26.67 133.14,26.67 JPP6.6
92  (via drill 0.61)
  Top 0.254: UU6.6 v132.59,8.53 v132.6,8.53
  Bottom 0.254: v132.6,8.53 132.6,19.41 133.18,19.99 135.88,19.99 138.11,22.21 138.11,24.18 JPP6.3 136.87,25.37 135.72,26.52 133.66,26.52 132.51,25.37 T97.1
93  (via drill 0.61)
  Top 0.254: T99.1 JPP6.4 | UU6.7 133.24,11.82 132.54,12.52 128.41,12.52 127.61,11.73 v125.39,11.73
  Bottom 0.254: JPP6.4 133.14,24.13 127.61,24.13 127.14,23.65 127.14,12.52 126.34,11.73 v125.39,11.73
94  (via drill 0.61)
  Top 0.254: UU6.4 131.29,8.54 v131.32,8.52
  Bottom 0.254: T95.1 132.51,22.83 133.66,23.97 135.78,23.97 JPP6.1 136.92,22.09 135.38,20.56 132.61,20.56 131.32,19.27 v131.32,8.52
95  (via drill 0.61)
  Top 0.254: T94.1 JPP6.2 | UU6.5 131.94,11.85 131.75,12.05 128.88,12.05 127.93,11.09 | 127.93,11.09 | 127.93,11.09 127.29,10.46 v125.39,10.46
  Bottom 0.254: JPP6.2 132.66,21.11 128.57,21.11 127.61,20.15 127.61,11.25 126.82,10.46 v125.39,10.46
96
  Top 0.254: JPP6.13 137.61,38.07 137.61,38.01 139.32,36.3 139.32,21.74 137.96,20.39 134.9,20.39 133.28,18.77 133.28,16.87 UU6.22
  Bottom 0.254: JPP6.13 135.59,39.39 132.7,39.39 131.93,38.62 T85.2
100
  Top 0.254: T1.2 JPP1.16 51.42,40.54 51.42,40.03 50.79,39.39 44.75,39.39 42.84,37.49 42.84,15.86 44.75,13.95 51.27,13.95 52.17,14.86 UU1.19
101
  Top 0.254: JPP1.15 54.41,40.13 56.91,37.64 56.91,21.75 55.07,19.91 52.23,19.91 51.54,19.22 51.54,16.87 UU1.20
  Bottom 0.254: JPP1.15 52.56,41.94 49.67,41.94 48.9,41.17 T2.2
102
  Top 0.254: T3.2 JPP1.14 51.35,37.45 50.68,36.78 44.99,36.78 | 44.99,36.78 44.94,36.78 | 44.99,36.78 43.31,35.1 43.31,16.18 45.06,14.43 50.15,14.43 50.87,15.15 UU1.21
103
  Top 0.254: JPP1.13 54.58,38.07 54.58,38.01 56.29,36.3 56.29,21.9 54.78,20.39 51.4,20.39 50.25,19.24 50.25,16.87 UU1.22
  Bottom 0.254: JPP1.13 52.57,39.39 49.67,39.39 48.9,38.62 T4.2
104
  Top 0.254: UU1.24 48.91,19.15 50.71,20.96 54.56,20.96 55.75,22.15 55.75,33.67 JPP1.11
  Bottom 0.254: JPP1.11 52.57,36.85 49.67,36.85 48.9,36.08 T5.2
105
  Top 0.254: JPP1.9 54.44,32.99 55.14,32.29 55.14,22.35 54.35,21.55 50.54,21.55 47.61,18.63 UU1.26
  Bottom 0.254: JPP1.9 52.58,34.31 49.67,34.31 48.91,33.54 T6.2
106  (via drill 0.61)
  Top 0.254: UU1.10 52.17,8.65 v52.06,8.55
  Bottom 0.254: v52.06,8.55 52.06,19.35 52.38,19.67 54.29,19.67 56.35,21.73 56.35,27.99 JPP1.7 52.58,31.76 49.67,31.76 48.91,31 T7.2
107  (via drill 0.61)
  Top 0.254: T8.2 JPP1.6 | UU1.9 51.52,12.11 50.63,13 v42.36,13
  Bottom 0.254: v42.36,13 42.84,13 43.32,13.48 43.32,14.11 43.32,14.59 43.32,25.24 44.75,26.67 50.12,26.67 JPP1.6
108  (via drill 0.61)
  Top 0.254: T10.1 JPP1.4 | UU1.7 50.22,11.82 49.52,12.52 45.38,12.52 44.59,11.73 v42.36,11.73
  Bottom 0.254: JPP1.4 50.11,24.13 44.91,24.13 43.79,23.02 43.79,12.36 43.16,11.73 v42.36,11.73
109  (via drill 0.61)
  Top 0.254: UU1.6 49.57,8.69 v49.41,8.53
  Bottom 0.254: T11.1 49.48,25.37 50.63,26.52 52.7,26.52 53.84,25.37 JPP1.3 55.08,24.18 55.08,22.21 53.81,20.94 50.79,20.94 49.57,19.72 49.57,8.69 v49.41,8.53
110  (via drill 0.61)
  Top 0.254: T12.1 JPP1.2 | UU1.5 48.92,11.85 48.72,12.05 45.86,12.05 44.91,11.09 | 44.91,11.09 | 44.91,11.09 44.27,10.46 v42.36,10.46
  Bottom 0.254: v42.36,10.46 43.16,10.46 44.27,11.57 44.27,20.31 45.07,21.11 49.21,21.11 50.93,22.83 JPP1.2
111  (via drill 0.61)
  Top 0.254: UU1.4 48.27,8.65 v48.13,8.52
  Bottom 0.254: T13.1 49.49,22.83 50.63,23.97 52.75,23.97 JPP1.1 53.89,22.14 53.26,21.51 52.52,21.51 50.54,21.51 48.29,19.27 48.29,8.68 v48.13,8.52
112
  Top 0.254: T14.2 48.89,35.53 JPP1.12 51.35,34.93 50.67,34.25 44.53,34.25 43.95,33.67 43.95,33.19 | UU1.23 49.57,15.44 49.04,14.91 45.38,14.91 43.95,16.34 43.95,33.19 | 43.95,33.19
113
  Top 0.254: T15.2 JPP1.10 51.35,32.36 50.68,31.69 45.06,31.69 44.59,31.22 44.59,16.5 45.7,15.38 47.93,15.38 48.27,15.73 UU1.25
114  (via drill 0.61)
  Top 0.254: JPP1.8 T16.2 | UU1.11 52.82,12.88 52.22,13.48 43.95,13.48 43.16,14.27 v42.36,14.27
  Bottom 0.254: JPP1.8 50.12,29.22 44.91,29.22 42.84,27.15 42.84,14.43 42.68,14.27 v42.36,14.27
115  (via drill 0.61)
  Top 0.254: UU1.8 50.87,8.63 v50.79,8.55
  Bottom 0.254: v50.79,8.55 50.79,19.67 51.42,20.3 54.13,20.3 55.72,21.89 55.72,25.93 JPP1.5 52.74,29.06 50.79,29.06 49.67,27.95 48.94,27.95 T17.2
116
  Top 0.254: T18.2 JPP2.16 67.62,40.54 67.62,40.03 66.98,39.39 60.94,39.39 59.03,37.49 59.03,15.86 60.94,13.95 67.46,13.95 68.36,14.86 UU2.19
117
  Top 0.254: JPP2.15 70.6,40.61 73.1,38.11 73.1,21.27 71.58,19.75 68.1,19.75 67.73,19.38 67.73,16.87 UU2.20
  Bottom 0.254: JPP2.15 68.76,41.94 65.87,41.94 65.09,41.17 T19.2
118
  Top 0.254: T20.2 JPP2.14 67.55,37.45 66.88,36.78 61.19,36.78 | 61.19,36.78 61.13,36.78 | 61.19,36.78 59.51,35.1 59.51,16.18 61.26,14.43 66.34,14.43 67.06,15.15 UU2.21
119
  Top 0.254: JPP2.13 70.78,38.07 70.78,38.01 72.48,36.3 72.48,21.58 71.29,20.39 67.27,20.39 66.44,19.56 66.44,16.87 UU2.22
  Bottom 0.254: JPP2.13 68.76,39.39 65.87,39.39 65.09,38.62 T21.2
120
  Top 0.254: T22.2 65.09,35.53 JPP2.12 67.55,34.93 66.87,34.25 60.72,34.25 60.14,33.67 60.14,33.19 | UU2.23 65.76,15.44 65.23,14.91 61.58,14.91 60.14,16.34 60.14,33.19 | 60.14,33.19
121
  Top 0.254: T23.2 JPP2.10 67.55,32.36 66.88,31.69 61.25,31.69 60.78,31.22 60.78,16.5 61.89,15.38 64.12,15.38 64.46,15.73 UU2.25
122  (via drill 0.61)
  Top 0.254: JPP2.8 T24.2 | UU2.11 69.01,12.88 68.41,13.48 60.14,13.48 59.19,14.43 v58.87,14.75
  Bottom 0.254: JPP2.8 66.31,29.22 61.1,29.22 58.55,26.68 58.55,15.07 58.71,14.91 v58.87,14.75
123  (via drill 0.61)
  Top 0.254: T25.2 JPP2.6 | UU2.9 67.71,12.11 66.82,13 v58.87,13
  Bottom 0.254: v58.87,13 59.19,13 59.83,13.64 59.83,13.95 59.83,14.43 59.83,25.56 60.94,26.67 66.31,26.67 JPP2.6
124  (via drill 0.61)
  Top 0.254: T26.1 JPP2.4 | UU2.7 66.41,11.82 65.71,12.52 61.58,12.52 60.78,11.73 v58.87,11.73
  Bottom 0.254: JPP2.4 66.31,24.13 60.62,24.13 60.3,23.81 60.3,12.52 59.51,11.73 v58.87,11.73
125  (via drill 0.61)
  Top 0.254: UU2.6 v65.76,8.53 v65.77,8.53
  Bottom 0.254: v65.77,8.53 65.77,19.41 66.36,20 68.26,20 69.85,21.59 70.64,21.59 71.28,22.22 71.28,24.18 JPP2.3 70.03,25.37 68.89,26.52 66.82,26.52 65.68,25.37 T27.1
126  (via drill 0.61)
  Top 0.254: T28.1 JPP2.2 | UU2.5 65.11,11.85 64.91,12.05 62.05,12.05 61.1,11.09 | 61.1,11.09 | 61.1,11.09 60.46,10.46 v58.87,10.46
  Bottom 0.254: JPP2.2 65.82,21.11 61.42,21.11 60.78,20.47 60.78,10.93 60.3,10.46 v58.87,10.46
127  (via drill 0.61)
  Top 0.254: UU2.4 64.46,8.54 v64.48,8.52
  Bottom 0.254: T29.1 65.68,22.83 66.82,23.97 68.94,23.97 JPP2.1 70.09,22.73 67.91,20.56 65.78,20.56 64.48,19.27 v64.48,8.52
128
  Top 0.254: UU2.24 65.1,19.15 66.91,20.96 70.91,20.96 71.94,21.99 71.94,33.67 JPP2.11
  Bottom 0.254: JPP2.11 68.76,36.85 65.87,36.85 65.09,36.08 T30.2
129
  Top 0.254: JPP2.9 70.63,32.99 71.34,32.29 71.34,22.19 70.7,21.55 66.73,21.55 63.8,18.63 UU2.26
  Bottom 0.254: JPP2.9 68.77,34.31 65.87,34.31 65.1,33.54 T31.2
130  (via drill 0.61)
  Top 0.254: UU2.10 68.36,8.65 v68.41,8.55
  Bottom 0.254: v68.41,8.55 68.41,18.56 68.57,18.71 68.57,18.72 70.17,20.32 71.12,20.32 72.39,21.59 72.39,28.14 72.39,28.15 JPP2.7 68.77,31.76 65.87,31.76 65.1,31 T32.2
131  (via drill 0.61)
  Top 0.254: UU2.8 67.06,8.63 v67.14,8.55
  Bottom 0.254: v67.14,8.55 67.14,18.71 67.78,19.35 68.4,19.35 70.01,20.95 70.8,20.95 71.91,22.07 71.91,26.08 JPP2.5 68.94,29.06 66.98,29.06 65.87,27.95 65.13,27.95 T33.2
132
  Top 0.254: T34.2 JPP3.16 84.29,40.54 84.29,40.03 83.65,39.39 77.61,39.39 75.86,37.65 75.86,15.86 77.61,13.95 84.13,13.95 85.03,14.86 UU3.19
133
  Top 0.254: JPP3.15 87.27,40.61 89.77,38.11 89.77,21.43 88.25,19.91 85.41,19.91 84.4,18.9 84.4,16.87 UU3.20
  Bottom 0.254: JPP3.15 85.43,41.94 82.54,41.94 81.76,41.17 T35.2
134
  Top 0.254: T36.2 JPP3.14 84.21,37.45 83.54,36.78 77.85,36.78 | 77.85,36.78 77.8,36.78 | 77.85,36.78 76.34,35.1 76.34,16.02 77.93,14.43 83.01,14.43 83.73,15.15 UU3.21
135
  Top 0.254: JPP3.13 87.44,38.07 87.44,38.01 89.15,36.3 89.15,21.74 87.8,20.39 84.73,20.39 83.11,18.77 83.11,16.87 UU3.22
  Bottom 0.254: JPP3.13 85.43,39.39 82.54,39.39 81.76,38.62 T37.2
136
  Top 0.254: UU3.24 81.77,19 83.73,20.96 87.58,20.96 88.61,21.99 88.61,33.67 JPP3.11
  Bottom 0.254: JPP3.11 85.43,36.85 82.54,36.85 81.76,36.08 T38.2
137
  Top 0.254: T39.2 JPP3.10 84.21,32.36 83.54,31.69 77.92,31.69 77.45,31.22 77.45,16.5 78.56,15.38 80.79,15.38 81.13,15.73 UU3.25
138  (via drill 0.61)
  Top 0.254: JPP3.8 T40.2 | UU3.11 85.68,12.88 85.08,13.48 76.81,13.48 76.02,14.27 v75.22,14.27
  Bottom 0.254: JPP3.8 82.98,29.22 76.81,29.22 76.02,28.42 76.02,14.59 75.7,14.27 v75.22,14.27
139  (via drill 0.61)
  Top 0.254: T41.2 JPP3.6 | UU3.9 84.38,12.11 83.49,13 v75.22,13
  Bottom 0.254: v75.22,13 76.02,13 76.5,13.48 76.5,13.64 76.5,14.11 76.5,26.04 77.13,26.67 82.98,26.67 JPP3.6
140  (via drill 0.61)
  Top 0.254: T42.1 JPP3.4 | UU3.7 83.08,11.82 82.38,12.52 78.24,12.52 77.45,11.73 v75.22,11.73
  Bottom 0.254: JPP3.4 82.97,24.13 77.45,24.13 76.97,23.65 76.97,12.52 76.18,11.73 v75.22,11.73
141  (via drill 0.61)
  Top 0.254: UU3.6 v82.43,8.53
  Bottom 0.254: v82.43,8.53 82.43,19.41 83.01,19.99 85.72,19.99 87.94,22.21 87.94,24.18 JPP3.3 86.7,25.37 85.56,26.52 83.49,26.52 82.35,25.37 T43.1
142  (via drill 0.61)
  Top 0.254: T44.1 JPP3.2 | UU3.5 81.78,11.85 81.58,12.05 78.72,12.05 77.77,11.09 | 77.77,11.09 | 77.77,11.09 77.13,10.46 v75.22,10.46
  Bottom 0.254: JPP3.2 82.49,21.11 78.4,21.11 77.45,20.15 77.45,11.25 76.65,10.46 v75.22,10.46
143  (via drill 0.61)
  Top 0.254: UU3.4 81.13,8.54 v81.15,8.52
  Bottom 0.254: T45.1 82.35,22.83 83.49,23.97 85.61,23.97 JPP3.1 86.75,22.09 85.22,20.56 82.45,20.56 81.15,19.27 v81.15,8.52
144
  Top 0.254: T46.2 81.75,35.53 JPP3.12 84.21,34.93 83.53,34.25 77.39,34.25 76.81,33.67 76.81,33.19 | UU3.23 82.43,15.44 81.9,14.91 78.24,14.91 76.81,16.34 76.81,33.19 | 76.81,33.19
145
  Top 0.254: JPP3.9 87.3,32.99 88.11,32.19 88.11,22.23 87.47,21.59 83.34,21.59 80.96,19.21 80.8,19.21 80.47,18.88 UU3.26
  Bottom 0.254: JPP3.9 85.44,34.31 82.54,34.31 81.77,33.54 T47.2
146  (via drill 0.61)
  Top 0.254: UU3.10 85.03,8.65 v85.08,8.55
  Bottom 0.254: v85.08,8.55 85.08,18.24 85.56,18.71 86.83,18.71 89.37,21.26 89.37,27.83 JPP3.7 85.44,31.76 82.54,31.76 81.77,31 T48.2
147  (via drill 0.61)
  Top 0.254: UU3.8 83.73,8.63 v83.81,8.55
  Bottom 0.254: v83.81,8.55 83.81,18.87 84.28,19.35 86.35,19.35 88.74,21.89 88.74,25.93 JPP3.5 85.6,29.06 83.65,29.06 82.54,27.95 81.8,27.95 T49.2
+3V3F1  (via drill 0.61)
  Top 0.406: X1.8 29.21,49.36 29.21,52.86 | CA7.1 35.78,57.32 P2.4 30.32,56.94 v30.32,56.99 | 29.21,52.86 29.21,59.53 JP11.2 | v23.65,51.59 27.94,51.59 29.21,52.86
  Bottom 0.406: CA49.+ 39.32,57.32 35.78,57.32 P2.4 | JP11.2 CA38.1 30.32,60.64 v30.32,56.99 | RF4.2 22.22,53.03 v23.65,51.59
+3V31  (via drill 0.6, 0.61)
  Top 0.254: UA1.105 28.84,8.15 v28.89,8.1 | v12.86,15.72 12,16.57 UA1.62 | UA1.125 29.73,19.57 v29.69,19.53 | UA1.57 12.2,19.07 v12.86,18.42 | 10.81,21.59 UA1.52 11.73,21.57 12.7,21.59 21.91,21.59 v22.54,20.95 | UA1.11 25.34,29.75 26.67,28.42 v27.62,28.42 | U6.16 65.66,47.72 65.25,47.31 65.25,47.15 | U7.16 65.31,57.88 v64.77,58.42 | 65.25,47.15 65.25,45.4 C6.1 | C8.1 49.69,46.36 49.37,46.67 | 49.37,46.67 49.37,47.47 49.78,47.88 U8.16 | C4.1 83.66,47.46 83.41,47.72 U4.16 | U9.10 v53.29,61.95 | U6.10 65.53,51.63 65.25,51.91 64.45,51.91 63.98,51.43 63.98,48.42 65.25,47.15 | U4.10 81.08,51.63 79.22,53.5 | U7.10 65.37,61.79 64.77,62.39 64.77,62.87 v65.41,63.5 | U9.16 49.12,58.04 v49.05,58.1 | U8.10 48.77,51.79 48.26,51.28 48.26,47.78 49.37,46.67 | U5.16 81.03,57.88 v80.49,58.42 | UUU3.16 115.82,47.72 115.41,47.31 115.41,47.15 | UUU4.16 115.47,57.88 v114.94,58.42 | 115.41,47.15 115.41,45.4 C104.1 | C103.1 99.85,46.36 99.54,46.67 | 99.54,46.67 99.54,47.47 99.95,47.88 UUU5.16 | C105.1 133.83,47.46 133.57,47.72 UUU1.16 | UUU6.10 v103.46,61.95 | UUU3.10 115.69,51.63 115.41,51.91 114.62,51.91 114.14,51.43 114.14,48.42 115.41,47.15 | UUU1.10 131.25,51.63 129.38,53.5 | UUU4.10 115.53,61.79 114.94,62.39 114.94,62.87 v115.57,63.5 | UUU6.16 99.28,58.04 v99.22,58.1 | UUU5.10 98.94,51.79 98.43,51.28 98.43,47.78 99.54,46.67 | UUU2.16 131.19,57.88 v130.65,58.42 | UUU2.10 131.01,61.79 v130.65,61.44
  Top 0.305: 82.17,47.72 U4.16 | 132.33,47.72 UUU1.16
  Top 0.406: 51.59,44.45 62.23,44.45 | 62.23,44.45 64.77,44.45 | 64.77,44.45 78.26,44.45 | 78.26,44.45 83.03,44.45 | ERASE.1 36.51,8.01 | 47.62,54.45 47.62,46.2 49.37,44.45 51.59,44.45 | 47.62,54.45 v50.01,56.83 | v66.2,56.83 65.25,56.83 63.34,54.93 63.34,45.56 62.23,44.45 | v81.91,56.67 80.8,56.67 79.22,55.09 79.22,53.5 79.22,45.4 78.26,44.45 | C6.1 65.25,44.92 64.77,44.45 | C8.1 50.64,45.4 51.59,44.45 | 83.03,44.45 83.66,45.09 C4.1 | UU3.1 79.18,9.84 78.23,8.89 C3.1 77.31,8.41 76.36,7.46 | UU2.1 62.51,10.48 60.92,8.89 C2.1 60.32,8.41 59.37,7.46 | UU1.1 46.32,10 45.21,8.89 C1.1 44.45,8.41 43.5,7.46 | 43.5,7.46 42.55,7.46 v42.39,7.3 | 43.5,7.46 59.37,7.46 | 59.37,7.46 76.36,7.46 | 47.62,54.45 45.4,52.23 v41.59,52.23 | v38.89,6.19 36.84,8.24 ERASE.1 | v36.04,10 36.75,8.97 ERASE.1 | UU6.1 129.34,9.84 128.39,8.89 C102.1 127.47,8.41 126.52,7.46 | UU4.1 96.48,10 95.37,8.89 C100.1 94.62,8.41 93.66,7.46 | UU5.1 112.68,10.48 111.09,8.89 C101.1 110.49,8.41 109.54,7.46 | v131.92,6.67 129.38,6.67 128.59,7.46 126.52,7.46 | 109.54,7.46 126.52,7.46 | 93.66,7.46 109.54,7.46 | 99.85,44.45 112.4,44.45 | 112.4,44.45 114.94,44.45 | 114.94,44.45 128.43,44.45 | 128.43,44.45 133.19,44.45 133.27,44.53 | v100.17,56.83 97.79,54.45 97.79,46.2 96.04,44.45 | v116.36,56.83 115.41,56.83 113.51,54.93 113.51,45.56 112.4,44.45 | v132.08,56.67 130.97,56.67 129.38,55.09 129.38,53.5 129.38,45.4 128.43,44.45 | C104.1 115.41,44.92 114.94,44.45 | C103.1 100.81,45.4 99.85,44.45 | 96.04,44.45 99.85,44.45 | 133.27,44.53 133.83,45.09 C105.1 | 133.35,44.45 133.27,44.53 | 83.03,44.45 96.04,44.45 | 76.36,7.46 93.66,7.46 | U5.10 81.24,61.79 80.8,62.23 80.8,62.71 81.44,63.34 84.61,63.34 v85.25,62.71
  Top 0.406: v149.86,11.43 AMPTI.4
  Bottom 0.254: 14.56,16.19 CA4.1 | RA3.1 10.33,17.14 13.02,17.14 14.22,15.94 CA4.1 | 14.24,15.56 CA4.1 | CA4.1 14.13,16.43 14.13,17.14 v12.86,18.42 | 20.69,20.64 arc-90 CA6.1 20.88,20.95 v22.54,20.95 | CA8.1 26.96,27.81 27.56,28.42 v27.62,28.42 | v50.01,56.84 v50.01,56.83 | CA9.1 28.1,19.53 v29.69,19.53 | v28.89,8.1 28.92,8.13 CA3.1 | JP9.2 41.12,16.99 41.12,10.32 42.39,9.05 v42.39,7.3 | v53.29,61.95 53.29,61.07 C9.1 50.01,60.32 49.05,59.37 v49.05,58.1 | v64.77,58.42 64.77,59.69 65.88,60.8 C7.1 68.1,60.8 v65.41,63.5 | v80.49,58.42 80.49,59.85 81.28,60.64 C5.1 | v100.17,56.84 v100.17,56.83 | v103.46,61.95 103.46,61.07 C106.1 100.17,60.32 99.22,59.37 v99.22,58.1 | v114.94,58.42 114.94,59.69 116.05,60.8 C107.1 118.27,60.8 v115.57,63.5 | v130.65,58.42 130.65,59.85 131.44,60.64 C108.1 133.51,61.44 v130.65,61.44
  Bottom 0.406: 30.64,12.22 28.26,14.61 25.4,14.61 23.65,16.35 23.65,19.21 | 30.64,12.22 30.64,10.48 29.69,9.53 | 29.69,9.53 29.07,9.53 CA3.1 | 29.69,9.53 29.69,9.37 | CA9.1 27.94,19.53 27.62,19.85 27.62,20.16 23.65,24.13 | 23.65,24.13 23.65,25.06 | 23.65,19.21 23.65,20.48 | 23.65,20.48 23.65,24.13 | L1.1 16.72,11.84 16.02,12.54 14.92,12.54 14.24,11.86 RA4.1 13.65,11.89 13.65,12.54 13.02,13.18 | 13.02,13.18 12.54,13.18 12.2,13.52 BR1.3 | 13.18,14.61 13.81,13.97 CA5.1 CA4.1 14.92,16.27 14.92,16.99 15.24,17.3 21.91,17.3 23.03,18.56 | 13.18,14.61 13.18,15.4 v12.86,15.72 | 23.03,18.56 23.18,18.73 23.65,19.21 | RA5.2 23.02,18.57 23.03,18.56 | CA6.1 20.89,20.7 21.75,19.84 23.02,19.84 23.65,20.48 | 13.02,13.18 13.18,13.34 13.18,14.61 | 23.65,25.06 23.65,26.19 24.77,27.15 27.1,27.15 CA8.1 | 23.65,25.06 L2.1 | v66.2,56.83 68.42,59.06 C7.1 | CA2.+ 34.98,52.52 P2.6 36.11,52.23 CA1.1 v41.59,52.23 | 49.85,56.67 v50.01,56.83 53.02,59.85 C9.1 | CA2.+ 32.07,52.39 | v27.62,28.42 26.02,30.02 26.02,42.37 CA21.1 28.88,48.56 32.39,52.07 32.39,53.02 32.2,52.84 CA2.+ | v38.89,6.19 41.27,6.19 v42.39,7.3 | 30.64,12.22 32.86,10 v36.04,10 | v81.91,56.67 82.23,56.67 84.14,58.58 C5.1 84.14,61.12 85.25,62.23 v85.25,62.71 | v116.36,56.83 118.59,59.06 C107.1 | 100.01,56.67 v100.17,56.83 103.19,59.85 C106.1 | v132.08,56.67 132.4,56.67 134.3,58.58 C108.1 | 138.11,6.67 v131.92,6.67 | 138.11,6.67 138.43,6.67 | v149.86,11.43 148.16,11.43 CA28.1 146.53,9.79 146.53,8.57 144.62,6.67 138.11,6.67
+5V
  Top 0.406: CA54.1 JP10.1
  Bottom 0.406: P2.1 36.12,63.66 JP10.1 CA37.+
-5V  (via drill 0.6)
  Top 0.406: v145.89,13.81 143.51,11.43 AMPTI.11
  Bottom 0.406: P2.2 36.05,61.59 41.23,61.59 41.91,60.91 CA51.1 43.8,60.37 CA50.- 45.6,60.52 50.48,65.4 144.3,65.4 145.1,64.61 145.1,21.11 147.95,18.26 147.95,12.54 147.48,12.06 CA29.2 146.53,12.11 146.53,13.18 v145.89,13.81
A0
  Top 0.254: 56.04,43.81 43.18,43.81 40.32,40.96 40.32,34.61 34.78,29.07 UA1.144 | 56.04,43.81 74.14,43.81 | 74.14,43.81 75.25,42.7 75.25,16.19 73.01,13.95 70.64,13.95 69.66,14.93 UU2.17 | 91.6,43.81 92.39,43.02 92.39,21.59 89.53,18.73 89.53,15.87 88.42,14.76 87.15,14.76 86.33,15.59 UU3.17 | 91.6,43.81 74.14,43.81 | 56.04,43.81 56.52,43.34 56.52,42.54 57.47,41.59 57.47,21.59 53.47,17.59 UU1.17 | 124.3,43.81 106.2,43.81 | 124.3,43.81 125.41,42.54 125.41,16.19 123.17,13.95 120.8,13.95 119.82,14.93 UU5.17 | UU6.17 136.49,15.59 137.32,14.76 138.59,14.76 139.7,15.87 139.7,18.73 142.56,21.59 142.56,39.21 137.95,43.81 124.3,43.81 | UU4.17 103.63,17.59 107.63,21.59 107.63,41.59 106.68,42.54 106.68,43.34 106.2,43.81 | 106.2,43.81 91.6,43.81
A00  (via drill 0.61)
  Top 0.254: U4.15 83.62,48.38 v83.82,48.58
  Bottom 0.254: JP4.1 92.23,47.47 90.33,47.47 89.22,48.58 v83.82,48.58
A1  (via drill 0.6, 0.61)
  Top 0.254: 73.03,42.23 74.29,40.96 74.29,16.03 72.85,14.59 70.8,14.59 70.31,15.08 UU2.16 | 73.03,42.23 72.39,42.86 v57.47,42.86 57.94,42.39 57.94,21.27 54.12,17.45 UU1.16 | 89.69,42.86 v91.12,42.86 | 89.69,42.86 76.84,42.86 v76.2,42.23 | v74.29,42.23 73.03,42.23 | UA1.139 33.24,26.57 40.96,34.29 40.96,40.8 43.02,42.86 v55.56,42.86 | UU6.16 137.14,15.71 137.61,15.24 138.11,15.24 138.91,16.03 138.91,18.73 141.92,21.75 141.92,39.05 138.11,42.86 127,42.86 v126.37,42.23 | 123.19,42.23 124.46,40.96 124.46,16.03 123.02,14.59 120.96,14.59 120.47,15.08 UU5.16 | 123.19,42.23 122.56,42.86 v107.63,42.86 108.11,42.39 108.11,21.27 104.28,17.45 UU4.16 | v124.46,42.23 123.19,42.23 | v105.73,42.86 v93.34,42.86 | 89.69,42.86 91.76,40.8 91.76,21.75 88.74,18.73 88.74,16.03 87.95,15.24 87.45,15.24 86.98,15.71 UU3.16
  Bottom 0.254: v76.2,42.23 v74.29,42.23 | v55.56,42.86 v57.47,42.86 | v126.37,42.23 v124.46,42.23 | v105.73,42.86 v107.63,42.86 | v93.34,42.86 v91.12,42.86 90.65,42.86
A01  (via drill 0.61)
  Top 0.254: U5.15 83.22,58.54 83.5,58.26 83.5,56.36 v83.19,56.04
  Bottom 0.254: JP4.9 92.23,57.63 90.33,57.63 88.74,56.04 v83.19,56.04
A2  (via drill 0.6, 0.61)
  Top 0.254: v29.37,23.34 29.37,23.97 30.97,25.57 UA1.137 33.19,25.57 41.59,33.97 41.59,40.64 43.18,42.23 54.77,42.23 55.4,41.59 v56.2,41.59 | UA1.112 31.38,13.07 v30.64,13.81 | 71.75,40.64 73.66,38.73 73.66,20.95 70.96,18.26 UU2.15 | 71.75,40.64 70.17,42.23 62.07,42.23 61.44,41.59 v58.9,41.59 59.37,41.12 59.37,39.05 58.42,38.1 58.42,20.95 54.77,17.3 UU1.15 | 88.42,41.59 91.12,38.89 91.12,22.07 87.63,18.57 UU3.15 | 88.42,41.59 87.63,42.39 77.95,42.39 v76.2,40.64 | v73.34,40.64 71.75,40.64 | 121.92,40.64 123.82,38.73 123.82,20.95 121.12,18.26 UU5.15 | 121.92,40.64 120.33,42.23 112.24,42.23 111.6,41.59 v109.06,41.59 109.54,41.12 109.54,39.05 108.59,38.1 108.59,20.95 104.93,17.3 UU4.15 | v126.37,40.64 128.11,42.39 137.79,42.39 141.29,38.89 141.29,22.07 137.79,18.57 UU6.15 | v123.51,40.64 121.92,40.64 | v106.36,41.59 105.57,41.59 104.93,42.23 94.62,42.23 93.98,41.59 v93.34,41.59 | v89.69,41.59 88.42,41.59
  Bottom 0.254: v29.37,23.34 31.75,20.95 31.75,17.78 29.53,15.56 29.53,14.45 30.16,13.81 v30.64,13.81 | v76.2,40.64 v73.34,40.64 | v56.2,41.59 v58.9,41.59 | v126.37,40.64 v123.51,40.64 | v106.36,41.59 v109.06,41.59 | v93.34,41.59 v89.69,41.59
A02  (via drill 0.61)
  Top 0.254: v64.93,48.74 65.28,48.38 U6.15
  Bottom 0.254: v64.93,48.74 73.34,48.74 74.61,50.01 78.42,50.01 79.06,49.37 79.06,47.47 JP5.1
A03  (via drill 0.61)
  Top 0.254: U7.15 66.52,58.58 67.63,58.58 67.94,58.26 67.94,56.99 v67.63,56.67
  Bottom 0.254: JP5.9 76.52,57.63 68.58,57.63 v67.63,56.67
A3  (via drill 0.6, 0.61)
  Top 0.254: UU6.14 137.79,12.23 137.32,12.7 v136.84,12.7 | UU4.14 104.93,12.22 v105.89,13.18 | v106.36,40.01 104.62,41.75 95.41,41.75 93.98,40.32 v93.34,40.32 | UU5.14 121.12,11.59 v122.08,12.54 | UU3.14 87.63,12.23 87.15,12.7 v86.68,12.7 | UU1.14 54.77,12.22 v55.72,13.18 | v56.2,40.01 54.45,41.75 43.81,41.75 42.23,40.16 42.23,33.65 33.64,25.07 UA1.136 | UU2.14 70.96,11.59 v71.91,12.54
  Bottom 0.254: 120.01,43.34 112.87,43.34 109.54,40.01 v106.36,40.01 | 120.01,43.34 122.08,41.28 122.08,40.01 123.98,38.1 123.98,21.27 122.08,19.37 v122.08,12.54 | v136.84,12.7 136.84,17.46 140.65,21.27 140.65,40.64 137.95,43.34 120.01,43.34 | v106.36,40.01 106.84,40.01 | v106.36,40.01 107.16,39.21 107.16,14.45 v105.89,13.18 | 69.85,43.34 62.71,43.34 59.37,40.01 v56.2,40.01 | 69.85,43.34 71.91,41.28 71.91,40.01 73.82,38.1 73.82,21.27 71.91,19.37 v71.91,12.54 | v86.68,12.7 86.68,17.46 90.49,21.27 90.49,39.53 89.61,40.4 | 89.61,40.4 86.68,43.34 69.85,43.34 | v56.2,40.01 56.67,40.01 | v56.2,40.01 56.99,39.21 56.99,14.45 v55.72,13.18 | v93.34,40.32 89.69,40.32 89.61,40.4
A4  (via drill 0.61)
  Top 0.254: U8.15 50.48,48.58 v49.21,48.58
  Bottom 0.254: JP6.1 60.64,47.62 58.9,47.62 57.94,48.58 v49.21,48.58
A5  (via drill 0.61)
  Top 0.254: v52.07,57.15 52.07,58.42 51.79,58.7 U9.15
  Bottom 0.254: JP6.9 60.64,57.78 55.72,57.78 54.77,56.83 52.39,56.83 v52.07,57.15
AVREF  (via drill 0.61)
  Top 0.254: UA1.75 13.84,8.23 v13.81,7.94
  Bottom 0.254: L3.2 10.68,10.76 11.75,9.68 11.75,8.84 CA23.1 | 11.82,8.89 CA23.1 | CA23.1 12.01,8.89 13.49,8.89 13.81,8.57 v13.81,7.94
AVREFL
  Bottom 0.254: CA22.1 7.94,10.86 7.94,12.06 8.83,12.96 L3.1 9.91,12.8 10.79,11.91 11.67,11.91 RA4.2 11.75,11.98 11.75,12.54 10.95,13.34 10.95,14.19 arc90 BR1.2
B0
  Top 0.254: U4.1 88.96,47.72 90.49,46.2 JP4.2
B1
  Top 0.254: U5.1 88.81,57.88 90.33,56.36 JP4.10
B2
  Top 0.254: U6.1 73.25,47.72 74.77,46.2 JP5.2
B3
  Top 0.254: U7.1 73.09,57.88 74.61,56.36 JP5.10
B4
  Top 0.254: U8.1 57.53,47.88 59.21,46.2 JP6.2
B5
  Top 0.254: U9.1 57.37,58.04 59.05,56.36 JP6.10
C0
  Top 0.254: JP4.3 92.23,47.47 90.33,47.47 89.41,48.38 U4.2
C2
  Top 0.254: 76.52,47.47 76.76,47.7 | 76.76,47.7 JP5.3 | U6.2 73.7,48.38 74.37,47.7 | 74.37,47.7 74.61,47.47 | 74.37,47.7 74.29,47.62 76.84,47.62 76.76,47.7
C3
  Top 0.254: JP5.11 76.52,57.63 74.61,57.63 73.7,58.54 U7.2
C4
  Top 0.254: JP6.3 60.96,47.62 58.9,47.62 57.98,48.54 U8.2
C5
  Top 0.254: JP6.11 60.96,57.78 58.9,57.78 57.98,58.7 U9.2
CLOCK1  (via drill 0.6, 0.61)
  Top 0.254: 82.26,50.32 U4.12 80.95,50.34 v80.33,50.96 80.34,50.97 U4.11 83.46,50.97 84.77,52.29 84.77,60.01 84.28,60.5 | U9.12 52.86,60.64 | 66.54,60.48 U7.12 68.41,60.5 | 66.54,50.32 U6.12 65.55,50.34 v64.93,50.96 64.94,50.97 U6.11 | 66.57,61.12 U7.11 67.77,61.13 68.41,60.5 | U6.11 66.57,50.96 | 52.86,60.64 52.22,61.29 U9.11 50.83,61.28 v49.21,61.28 | U5.11 83.65,61.13 84.28,60.5 | 53.48,51.74 52.88,51.13 U8.11 50.84,51.12 49.53,51.12 49.21,50.8 v49.21,50.01 49.7,50.5 U8.12 50.85,50.48 | 53.48,51.74 53.48,60.02 52.86,60.64 | 69.22,52.86 69.22,59.69 68.41,60.5 | U6.11 67.32,50.97 69.22,52.86 | 69.22,52.86 v69.22,51.91 | UA1.133 36.6,23.57 37.47,22.7 v37.94,22.7 | 53.48,51.74 v54.29,52.55 | 132.42,50.32 UUU1.12 131.12,50.34 v130.49,50.96 v130.5,50.97 UUU1.11 133.62,50.97 134.94,52.29 134.94,60.01 134.46,60.48 | UUU6.12 100.99,60.64 103.03,60.64 | UUU4.12 118.57,60.5 | UUU3.12 115.72,50.34 v115.09,50.96 115.11,50.97 UUU3.11 | 116.73,61.12 UUU4.11 117.94,61.13 118.57,60.5 | UUU3.11 116.73,50.96 | 103.03,60.64 102.38,61.29 UUU6.11 100.99,61.28 v98.74,61.28 | 134.46,60.48 132.42,60.48 UUU2.12 | UUU2.11 133.81,61.13 134.46,60.48 | 103.65,51.74 103.04,51.13 UUU5.11 101,51.12 99.69,51.12 99.38,50.8 v99.38,50.01 99.87,50.5 UUU5.12 | 103.65,51.74 103.65,60.02 103.03,60.64 | 119.38,52.86 119.38,59.69 118.57,60.5 | UUU3.11 117.49,50.97 119.38,52.86 | 119.38,52.86 v119.38,51.91 | 103.65,51.74 v104.46,52.55 | v80.8,64.14 80.01,63.34 80.01,61.59 81.12,60.48 82.26,60.48 U5.12 84.28,60.5
  Bottom 0.254: v54.29,52.55 62.71,52.55 64.29,50.96 v64.93,50.96 | v69.22,51.91 69.85,52.55 78.74,52.55 v80.33,50.96 | v37.94,22.7 38.26,23.02 38.26,32.54 39.53,33.81 39.53,40.16 v49.21,50.01 | v104.46,52.55 112.87,52.55 114.46,50.96 v115.09,50.96 | v119.38,51.91 120.01,52.55 128.91,52.55 v130.49,50.96 | v80.8,64.14 81.44,64.77 88.9,64.77 89.69,63.98 89.69,63.34 90.33,62.71 97.31,62.71 v98.74,61.28
CR1
  Top 0.254: JP4.11 92.23,57.63 90.33,57.63 89.41,58.54 U5.2
D0
  Top 0.254: U4.3 90.66,49.04 JP4.4
D1
  Top 0.254: U5.3 90.66,59.2 JP4.12
D2
  Top 0.254: U6.3 74.94,49.04 JP5.4
D3
  Top 0.254: U7.3 74.94,59.2 JP5.12
D4
  Top 0.254: U8.3 59.07,49.2 JP6.4
D5
  Top 0.254: U9.3 59.07,59.36 JP6.12
D+  (via drill 0.61)
  Top 0.254: UA1.37 8.43,29.07 v8.41,29.05 8.1,29.37 8.1,38.1 9.53,39.53 18.41,39.53 18.89,40.01 18.89,41.75 16.99,43.66 14.76,43.66 13.96,42.85 Z1.1 13.26,41.75 6.83,41.75 5.71,42.86 X3.D+
  Bottom 0.254: v8.41,29.05 8.41,25.72 8.89,25.24 9.53,25.24 RA8.2
D-
  Top 0.254: RA7.2 7.41,27.46 8.73,27.46 9.84,28.57 UA1.38 11.59,28.57 11.91,28.89 11.91,29.21 11.59,29.53 9.37,29.53 8.73,30.16 8.73,37.94 9.68,38.89 18.89,38.89 19.53,39.53 19.53,42.07 17.46,44.13 15.56,44.13 14.76,44.89 Z2.1 12.05,43 X3.D-
DATA  (via drill 0.61)
  Top 0.254: v39.21,22.7 39.21,22.38 38.58,21.75 37.62,21.75 36.3,23.07 UA1.132 | v130.97,45.56 130.97,48.74 131.29,49.05 132.42,49.05 UUU1.14
  Bottom 0.254: v39.21,22.7 39.21,31.59 41.12,33.5 41.12,39.05 46.51,44.45 82.39,44.45 82.71,44.45 130.65,44.45 130.97,44.77 v130.97,45.56
DATA1
  Top 0.254: U4.9 83.41,52.29 84.14,53.02 84.14,58.42 83.36,59.2 U5.14
DATA2  (via drill 0.61)
  Top 0.254: U5.9 83.91,62.45 85.41,60.96 85.41,48.74 v87.63,46.51 | U6.14 66.57,49.05 67.47,49.05 67.94,48.58 67.94,47.47 68.9,46.51 v68.9,46.04
  Bottom 0.254: v68.9,46.04 69.85,45.09 78.9,45.09 80.33,46.51 v87.63,46.51
DATA4
  Top 0.254: U6.9 67.53,52.29 68.58,53.34 68.58,58.42 67.8,59.2 U7.14
DATA6  (via drill 0.61)
  Top 0.254: U7.9 68.04,62.45 70.33,60.17 v70.33,47.47 | v55.72,45.56 52.08,49.2 U8.14
  Bottom 0.254: v55.72,45.56 56.2,45.09 63.5,45.09 65.56,47.15 70.01,47.15 v70.33,47.47
DATA7
  Top 0.254: U8.9 51.66,52.45 53.02,53.82 53.02,58.74 52.4,59.36 U9.14
DATA13  (via drill 0.6)
  Top 0.254: UUU6.9 99.44,62.61 arc90 v99.38,62.55 | v80.33,49.05 80.34,49.04 U4.14
  Bottom 0.254: v80.33,49.05 80.34,49.04 U4.14 88.32,55.09 94.14,55.09 100.17,61.12 100.17,61.75 v99.38,62.55
DATA21